# Altium schematic sheet GWC-MCU-002-A - Voltages.SchDoc
size 420 x 297 mm; SheetNumber: 1; SheetTotal: 2; PageSetup: Record=PageOptions|CenterHorizontal=True|CenterVertical=True|PrintScale=0.96|XCorrection=1.00|YCorrection=1.00|PrintKind=1|BorderSize=5000000|LeftOffset=0|BottomOffset=0|Orientation=2|PaperLength=1000|PaperWidth=1000|Scale=100|PaperSource=15|PrintQuality=600|MediaType=1|DitherType=10|PrintScaleMode=1|PaperKind=A3 (297 x 420 mm)|PaperIndex=8
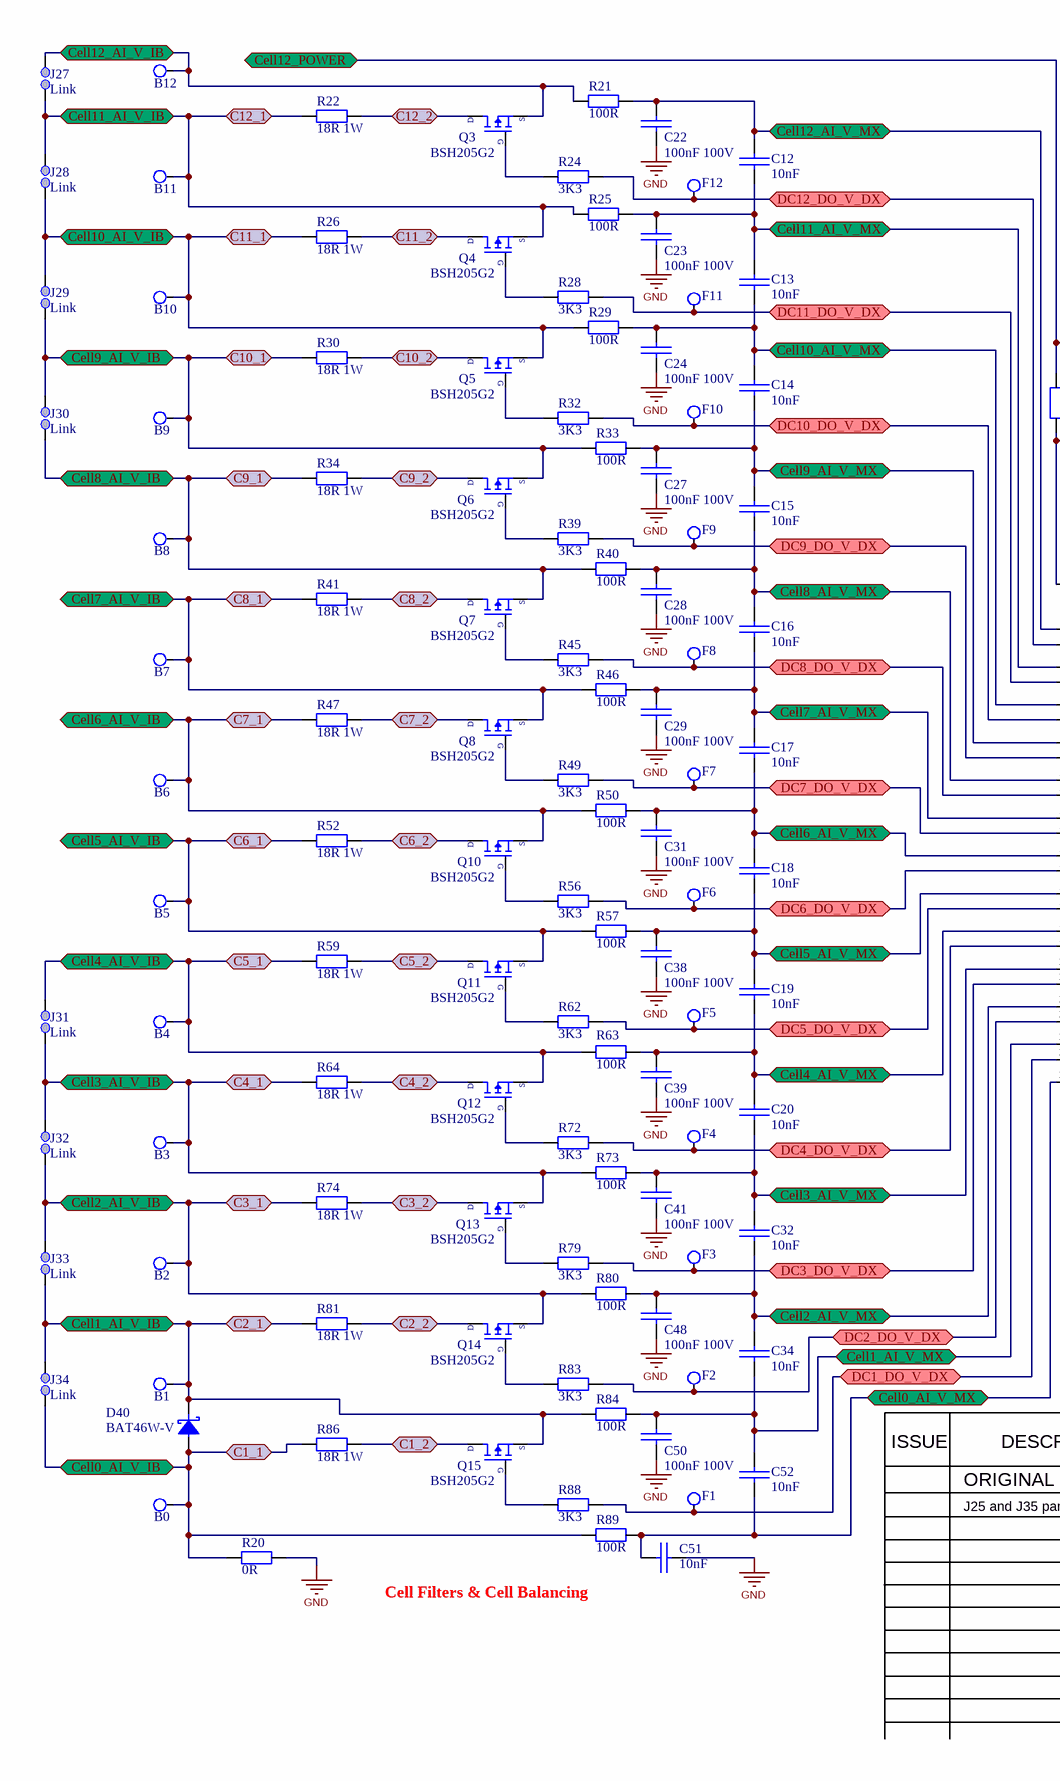
[diagram p0: GWC-MCU-002-A - Voltages.SchDoc, left]
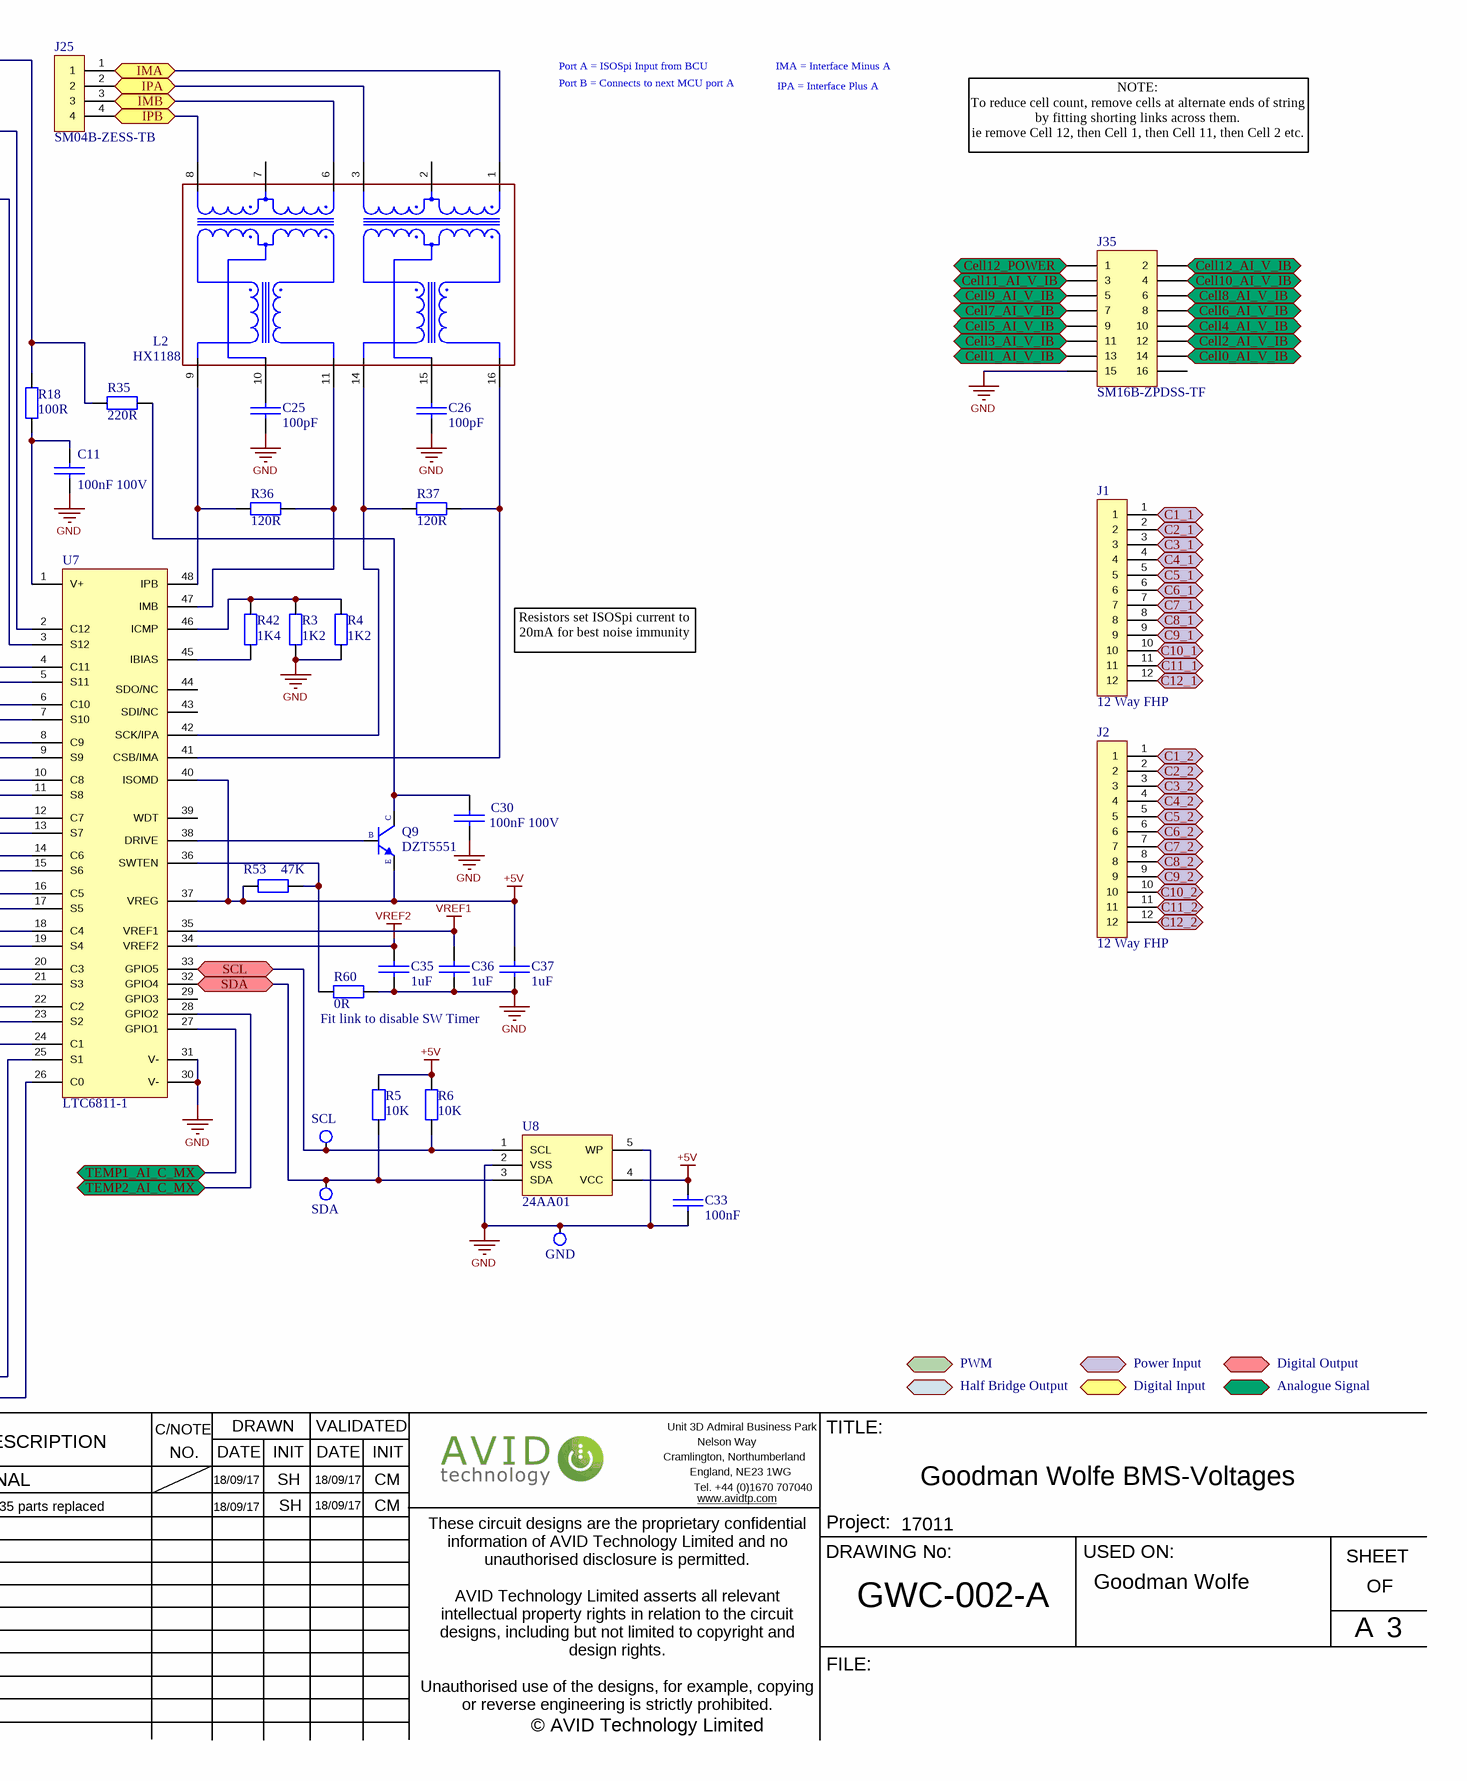
[diagram p1: GWC-MCU-002-A - Voltages.SchDoc, right]

## Parts
B0  TP  [Test Point]  (value not drawn)  (no BOM)
B1  TP  [Test Point]  (value not drawn)  (no BOM)
B2  TP  [Test Point]  (value not drawn)  (no BOM)
B3  TP  [Test Point]  (value not drawn)  (no BOM)
B4  TP  [Test Point]  (value not drawn)  (no BOM)
B5  TP  [Test Point]  (value not drawn)  (no BOM)
B6  TP  [Test Point]  (value not drawn)  (no BOM)
B7  TP  [Test Point]  (value not drawn)  (no BOM)
B8  TP  [Test Point]  (value not drawn)  (no BOM)
B9  TP  [Test Point]  (value not drawn)  (no BOM)
B10  TP  [Test Point]  (value not drawn)  (no BOM)
B11  TP  [Test Point]  (value not drawn)  (no BOM)
B12  TP  [Test Point]  (value not drawn)  (no BOM)
C11  100nF 100V  [C0805]
C12  10nF  [0603]
C13  10nF  [0603]
C14  10nF  [0603]
C15  10nF  [0603]
C16  10nF  [0603]
C17  10nF  [0603]
C18  10nF  [0603]
C19  10nF  [0603]
C20  10nF  [0603]
C22  100nF 100V  [C0805]
C23  100nF 100V  [C0805]
C24  100nF 100V  [C0805]
C25  100pF  [C0603]
C26  100pF  [C0603]
C27  100nF 100V  [C0805]
C28  100nF 100V  [C0805]
C29  100nF 100V  [C0805]
C30  100nF 100V  [C0805]
C31  100nF 100V  [C0805]
C32  10nF  [0603]
C33  100nF  [C0603]
C34  10nF  [0603]
C35  1uF  [C0603]
C36  1uF  [C0603]
C37  1uF  [C0603]
C38  100nF 100V  [C0805]
C39  100nF 100V  [C0805]
C41  100nF 100V  [C0805]
C48  100nF 100V  [C0805]
C50  100nF 100V  [C0805]
C51  10nF  [0603]
C52  10nF  [0603]
D40  BAT46W-V  [SOD-123]
F1  TP  [Test Point]  (value not drawn)  (no BOM)
F2  TP  [Test Point]  (value not drawn)  (no BOM)
F3  TP  [Test Point]  (value not drawn)  (no BOM)
F4  TP  [Test Point]  (value not drawn)  (no BOM)
F5  TP  [Test Point]  (value not drawn)  (no BOM)
F6  TP  [Test Point]  (value not drawn)  (no BOM)
F7  TP  [Test Point]  (value not drawn)  (no BOM)
F8  TP  [Test Point]  (value not drawn)  (no BOM)
F9  TP  [Test Point]  (value not drawn)  (no BOM)
F10  TP  [Test Point]  (value not drawn)  (no BOM)
F11  TP  [Test Point]  (value not drawn)  (no BOM)
F12  TP  [Test Point]  (value not drawn)  (no BOM)
GND  TP  [Test Point]  (value not drawn)  (no BOM)
J1  12 Way FHP  [12 WAY FHP SOCKET]
J2  12 Way FHP  [12 WAY FHP SOCKET]
J25  SM04B-ZESS-TB  [4 Way ZESS Connecctor]
J27  Link  [Solder Link]
J28  Link  [Solder Link]
J29  Link  [Solder Link]
J30  Link  [Solder Link]
J31  Link  [Solder Link]
J32  Link  [Solder Link]
J33  Link  [Solder Link]
J34  Link  [Solder Link]
J35  SM16B-ZPDSS-TF  [16 Way ZPD Connecctor]
L2  HX1188  [SO-16W-Choke]
Q3  BSH205G2  [SOT-23M]
Q4  BSH205G2  [SOT-23M]
Q5  BSH205G2  [SOT-23M]
Q6  BSH205G2  [SOT-23M]
Q7  BSH205G2  [SOT-23M]
Q8  BSH205G2  [SOT-23M]
Q9  DZT5551  [SOT-223T]
Q10  BSH205G2  [SOT-23M]
Q11  BSH205G2  [SOT-23M]
Q12  BSH205G2  [SOT-23M]
Q13  BSH205G2  [SOT-23M]
Q14  BSH205G2  [SOT-23M]
Q15  BSH205G2  [SOT-23M]
R3  1K2  [0603]
R4  1K2  [0603]
R5  10K  [0603]
R6  10K  [0603]
R18  100R  [0603]
R20  0R  [0603]
R21  100R  [0603]
R22  18R 1W  [2512]
R24  3K3  [0603]
R25  100R  [0603]
R26  18R 1W  [2512]
R28  3K3  [0603]
R29  100R  [0603]
R30  18R 1W  [2512]
R32  3K3  [0603]
R33  100R  [0603]
R34  18R 1W  [2512]
R35  220R  [1206]
R36  120R  [0603]
R37  120R  [0603]
R39  3K3  [0603]
R40  100R  [0603]
R41  18R 1W  [2512]
R42  1K4  [0603]
R45  3K3  [0603]
R46  100R  [0603]
R47  18R 1W  [2512]
R49  3K3  [0603]
R50  100R  [0603]
R52  18R 1W  [2512]
R53  47K  [0603]
R56  3K3  [0603]
R57  100R  [0603]
R59  18R 1W  [2512]
R60  0R  [0603]
R62  3K3  [0603]
R63  100R  [0603]
R64  18R 1W  [2512]
R72  3K3  [0603]
R73  100R  [0603]
R74  18R 1W  [2512]
R79  3K3  [0603]
R80  100R  [0603]
R81  18R 1W  [2512]
R83  3K3  [0603]
R84  100R  [0603]
R86  18R 1W  [2512]
R88  3K3  [0603]
R89  100R  [0603]
SCL  TP  [Test Point]  (value not drawn)  (no BOM)
SDA  TP  [Test Point]  (value not drawn)  (no BOM)
U7  LTC6811-1  [SSOP-48]
U8  24AA01  [SOT-23-5]

## Ports
 (bidir), C1_1 (bidir), C1_2 (bidir), C2_1 (bidir), C2_2 (bidir), C3_1 (bidir), C3_2 (bidir), C4_1 (bidir), C4_2 (bidir), C5_1 (bidir), C5_2 (bidir), C6_1 (bidir), C6_2 (bidir), C7_1 (bidir), C7_2 (bidir), C8_1 (bidir), C8_2 (bidir), C9_1 (bidir), C9_2 (bidir), C10_1 (bidir), C10_2 (bidir), C11_1 (bidir), C11_2 (bidir), C12_1 (bidir), C12_2 (bidir), Cell0_AI_V_IB (bidir), Cell0_AI_V_MX (bidir), Cell1_AI_V_IB (bidir), Cell1_AI_V_MX (bidir), Cell2_AI_V_IB (bidir), Cell2_AI_V_MX (bidir), Cell3_AI_V_IB (bidir), Cell3_AI_V_MX (bidir), Cell4_AI_V_IB (bidir), Cell4_AI_V_MX (bidir), Cell5_AI_V_IB (bidir), Cell5_AI_V_MX (bidir), Cell6_AI_V_IB (bidir), Cell6_AI_V_MX (bidir), Cell7_AI_V_IB (bidir), Cell7_AI_V_MX (bidir), Cell8_AI_V_IB (bidir), Cell8_AI_V_MX (bidir), Cell9_AI_V_IB (bidir), Cell9_AI_V_MX (bidir), Cell10_AI_V_IB (bidir), Cell10_AI_V_MX (bidir), Cell11_AI_V_IB (bidir), Cell11_AI_V_MX (bidir), Cell12_AI_V_IB (bidir), Cell12_AI_V_MX (bidir), Cell12_POWER (bidir), DC1_DO_V_DX (bidir), DC2_DO_V_DX (bidir), DC3_DO_V_DX (bidir), DC4_DO_V_DX (bidir), DC5_DO_V_DX (bidir), DC6_DO_V_DX (bidir), DC7_DO_V_DX (bidir), DC8_DO_V_DX (bidir), DC9_DO_V_DX (bidir), DC10_DO_V_DX (bidir), DC11_DO_V_DX (bidir), DC12_DO_V_DX (bidir), IMA (bidir), IMB (bidir), IPA (bidir), IPB (bidir), SCL (bidir), SDA (bidir), TEMP1_AI_C_MX (bidir), TEMP2_AI_C_MX (bidir)

## Nets
+5V: C33.1 C37.2 Q9.E R5.2 R6.2 R53.1 U7.37(VREG) U7.40(ISOMD) U8.4(VCC)
GND: C11.1 C22.1 C23.1 C24.1 C25.1 C26.1 C27.1 C28.1 C29.1 C30.1 C31.1 C33.2 C35.1 C36.1 C37.1 C38.1 C39.1 C41.1 C48.1 C50.1 C51.1 GND.1 J35.15 R3.1 R4.1 R20.2 R60.1 U7.30(V-) U7.31(V-) U8.2(VSS) U8.5(WP)
VREF1: C36.2 U7.35(VREF1)
VREF2: C35.2 U7.34(VREF2)
C1_1: B0.1 D40.A J1.1 J34.2 J35.14 R20.1 R86.2 R89.1 ; port Cell0_AI_V_IB, port C1_1
C1_2: J2.1 Q15.D(D1) R86.1 ; port C1_2
C2_1: B1.1 D40.K J1.2 J33.2 J34.1 J35.13 Q15.S R81.2 R84.1 ; port Cell1_AI_V_IB, port C2_1
C2_2: J2.2 Q14.D(D1) R81.1 ; port C2_2
C3_1: B2.1 J1.3 J32.2 J33.1 J35.12 Q14.S R74.2 R80.1 ; port Cell2_AI_V_IB, port C3_1
C3_2: J2.3 Q13.D(D1) R74.1 ; port C3_2
C4_1: B3.1 J1.4 J31.2 J32.1 J35.11 Q13.S R64.2 R73.1 ; port Cell3_AI_V_IB, port C4_1
C4_2: J2.4 Q12.D(D1) R64.1 ; port C4_2
C5_1: B4.1 J1.5 J31.1 J35.10 Q12.S R59.2 R63.1 ; port Cell4_AI_V_IB, port C5_1
C5_2: J2.5 Q11.D(D1) R59.1 ; port C5_2
C6_1: B5.1 J1.6 J35.9 Q11.S R52.2 R57.1 ; port Cell5_AI_V_IB, port C6_1
C6_2: J2.6 Q10.D(D1) R52.1 ; port C6_2
C7_1: B6.1 J1.7 J35.8 Q10.S R47.2 R50.1 ; port Cell6_AI_V_IB, port C7_1
C7_2: J2.7 Q8.D(D1) R47.1 ; port C7_2
C8_1: B7.1 J1.8 J35.7 Q8.S R41.2 R46.1 ; port Cell7_AI_V_IB, port C8_1
C8_2: J2.8 Q7.D(D1) R41.1 ; port C8_2
C9_1: B8.1 J1.9 J30.2 J35.6 Q7.S R34.2 R40.1 ; port Cell8_AI_V_IB, port C9_1
C9_2: J2.9 Q6.D(D1) R34.1 ; port C9_2
C10_1: B9.1 J1.10 J29.2 J30.1 J35.5 Q6.S R30.2 R33.1 ; port Cell9_AI_V_IB, port C10_1
C10_2: J2.10 Q5.D(D1) R30.1 ; port C10_2
C11_1: B10.1 J1.11 J28.2 J29.1 J35.4 Q5.S R26.2 R29.1 ; port Cell10_AI_V_IB, port C11_1
C11_2: J2.11 Q4.D(D1) R26.1 ; port C11_2
C12_1: B11.1 J1.12 J27.2 J28.1 J35.3 Q4.S R22.2 R25.1 ; port Cell11_AI_V_IB, port C12_1
C12_2: J2.12 Q3.D(D1) R22.1 ; port C12_2
Cell0_AI_V_MX: C51.2 C52.1 R89.2 U7.26(C0) ; port Cell0_AI_V_MX
Cell1_AI_V_MX: C34.1 C50.2 C52.2 R84.2 U7.24(C1) ; port Cell1_AI_V_MX
Cell2_AI_V_MX: C32.1 C34.2 C48.2 R80.2 U7.22(C2) ; port Cell2_AI_V_MX
Cell3_AI_V_MX: C20.1 C32.2 C41.2 R73.2 U7.20(C3) ; port Cell3_AI_V_MX
Cell4_AI_V_MX: C19.1 C20.2 C39.2 R63.2 U7.18(C4) ; port Cell4_AI_V_MX
Cell5_AI_V_MX: C18.1 C19.2 C38.2 R57.2 U7.16(C5) ; port Cell5_AI_V_MX
Cell6_AI_V_MX: C17.1 C18.2 C31.2 R50.2 U7.14(C6) ; port Cell6_AI_V_MX
Cell7_AI_V_MX: C16.1 C17.2 C29.2 R46.2 U7.12(C7) ; port Cell7_AI_V_MX
Cell8_AI_V_MX: C15.1 C16.2 C28.2 R40.2 U7.10(C8) ; port Cell8_AI_V_MX
Cell9_AI_V_MX: C14.1 C15.2 C27.2 R33.2 U7.8(C9) ; port Cell9_AI_V_MX
Cell10_AI_V_MX: C13.1 C14.2 C24.2 R29.2 U7.6(C10) ; port Cell10_AI_V_MX
Cell11_AI_V_MX: C12.1 C13.2 C23.2 R25.2 U7.4(C11) ; port Cell11_AI_V_MX
Cell12_AI_V_IB: B12.1 J27.1 J35.2 Q3.S R21.1 ; port Cell12_AI_V_IB
Cell12_AI_V_MX: C12.2 C22.2 R21.2 U7.2(C12) ; port Cell12_AI_V_MX
Cell12_POWER: J35.1 R18.2 R35.1 ; port Cell12_POWER
DC1_DO_V_DX: F1.1 R88.2 U7.25(S1) ; port DC1_DO_V_DX
DC2_DO_V_DX: F2.1 R83.2 U7.23(S2) ; port DC2_DO_V_DX
DC3_DO_V_DX: F3.1 R79.2 U7.21(S3) ; port DC3_DO_V_DX
DC4_DO_V_DX: F4.1 R72.2 U7.19(S4) ; port DC4_DO_V_DX
DC5_DO_V_DX: F5.1 R62.2 U7.17(S5) ; port DC5_DO_V_DX
DC6_DO_V_DX: F6.1 R56.2 U7.15(S6) ; port DC6_DO_V_DX
DC7_DO_V_DX: F7.1 R49.2 U7.13(S7) ; port DC7_DO_V_DX
DC8_DO_V_DX: F8.1 R45.2 U7.11(S8) ; port DC8_DO_V_DX
DC9_DO_V_DX: F9.1 R39.2 U7.9(S9) ; port DC9_DO_V_DX
DC10_DO_V_DX: F10.1 R32.2 U7.7(S10) ; port DC10_DO_V_DX
DC11_DO_V_DX: F11.1 R28.2 U7.5(S11) ; port DC11_DO_V_DX
DC12_DO_V_DX: F12.1 R24.2 U7.3(S12) ; port DC12_DO_V_DX
IMA: J25.1 L2.1(TD+) ; port IMA
IMB: J25.3 L2.6(RD+) ; port IMB
IPA: J25.2 L2.3(TD-) ; port IPA
IPB: J25.4 L2.8(RD-) ; port IPB
SCL: R6.1 SCL.1 U7.33(GPIO5) U8.1(SCL) ; port SCL
SDA: R5.1 SDA.1 U7.32(GPIO4) U8.3(SDA) ; port SDA
TEMP1_AI_C_MX: U7.27(GPIO1) ; port TEMP1_AI_C_MX
TEMP2_AI_C_MX: U7.28(GPIO2) ; port TEMP2_AI_C_MX
NetC11_2: C11.2 R18.1 U7.1(V+)
NetC25_2: C25.2 L2.10(CMT)
NetC26_2: C26.2 L2.15(CMT)
NetC30_2: C30.2 Q9.C R35.2
NetL2_9: L2.9(RX-) R36.1 U7.48(IPB)
NetL2_11: L2.11(RX+) R36.2 U7.47(IMB)
NetL2_14: L2.14(TX-) R37.1 U7.42(SCK/IPA)
NetL2_16: L2.16(TX+) R37.2 U7.41(CSB/IMA)
NetQ3_G: Q3.G R24.1
NetQ4_G: Q4.G R28.1
NetQ5_G: Q5.G R32.1
NetQ6_G: Q6.G R39.1
NetQ7_G: Q7.G R45.1
NetQ8_G: Q8.G R49.1
NetQ9_B: Q9.B U7.38(DRIVE)
NetQ10_G: Q10.G R56.1
NetQ11_G: Q11.G R62.1
NetQ12_G: Q12.G R72.1
NetQ13_G: Q13.G R79.1
NetQ14_G: Q14.G R83.1
NetQ15_G: Q15.G R88.1
NetR3_2: R3.2 R4.2 R42.2 U7.46(ICMP)
NetR42_1: R42.1 U7.45(IBIAS)
NetR53_2: R53.2 R60.2 U7.36(SWTEN)

Not connected (* = marked no-connect by the designer): J35 16; L2 2(TCT) 7(RCT); U7 29(GPIO3) 39(WDT) 43(SDI/NC) 44(SDO/NC)

## Notes on the sheet
- Port A = ISOSpi Input from BCU
- Port B = Connects to next MCU port A
- IMA = Interface Minus A
- IPA = Interface Plus A
- NOTE:
  To reduce cell count, remove cells at alternate ends of string by fitting shorting links across them.
  ie remove Cell 12, then Cell 1, then Cell 11, then Cell 2 etc.
- Resistors set ISOSpi current to 20mA for best noise immunity
- Fit link to disable SW Timer
- Half Bridge Output
- PWM
- Digital Input
- Power Input
- Digital Output
- Analogue Signal
- ISSUE
- ORIGINAL
- DESCRIPTION
- C/NOTE
- NO.
- DATE
- DRAWN
- 18/09/17
- INIT
- SH
- VALIDATED
- CM
- Cramlington, Northumberland
- Unit 3D Admiral Business Park
- England, NE23 1WG
- Tel. +44 (0)1670 707040
- Nelson Way
- www.avidtp.com
- TITLE:
- Goodman Wolfe BMS-Voltages
- J25 and J35 parts replaced
- DRAWING No:
- Project:
- 17011
- USED ON:
- SHEET
- Cell Filters & Cell Balancing
- GWC-002-A
- Goodman Wolfe
- A
- OF
- 3
- © AVID Technology Limited
- FILE:
- These circuit designs are the proprietary confidential information of AVID Technology Limited and no unauthorised disclosure is permitted.
  AVID Technology Limited asserts all relevant intellectual property rights in relation to the circuit designs, including but not limited to copyright and design rights.
  Unauthorised use of the designs, for example, copying or reverse engineering is strictly prohibited.

## Library data of the parts
B0-B12 F1-F12 GND SCL SDA = TP: Test point; Manufacturer: NA; Specification: 1.5mm dia Single Sided; Part Number: Test Point; Component Type: Pad
C11 C22-C24 C27-C31 C38 C39 C41 C48 C50 = 100nF X7R 0805: 100nF 0805 Non Polarised Capacitor; Manufacturer: AVX; Part Number: 08051C104K4T2A; Tolerance: 10%; Specification: X7R 100V; Component Type: SMD; Supplier: Farnell; Supplier No.: 183-3888; Supplier 1: Farnell; Supplier 2: Digi-Key; Supplier 3: Arrow; Supplier 4: Newark; Supplier Part Number 1: 1833888; Supplier Part Number 2: 478-4525-1-ND; Supplier Part Number 3: thCAXxQKhySVZl-gwSbrFi2B4okyfaS8lrYqWDAKxeI; Supplier Part Number 4: 85R5692
C12-C20 C32 C34 C52 = 10nF 0603 X7R: 10nF Non Polarised Capacitor; Part Number: C0603C103K5RACTU; Manufacturer: Kemet; Specification: X7R 50V; Tolerance: 10%; Component Type: SMD; Supplier: Farnell; Supplier No.: 141-4609; Supplier 1: Farnell; Supplier 2: Digi-Key; Supplier Part Number 1: 1414609; Supplier Part Number 2: 399-1091-1-ND
C25 C26 = 100pF 0603 COG: 100pF Non Polarised Capacitor; Manufacturer: Murata; Part Number: GRM1885C1H101JA01D; Tolerance: 5%; Specification: COG; Component Type: SMD; Supplier: Farnell; Supplier No.: 881-9866; Supplier 2: Digi-Key; Supplier Part Number 2: 490-1427-1-ND; Supplier 1: Farnell; Supplier Part Number 1: 8819866
C33 = 100nF X7R 0603: 100nF 0603 Non Polarised Capacitor; Manufacturer: Kemet; Part Number: C0603C104K5RAC; Tolerance: 10%; Specification: X7R 50V; Component Type: SMD; Supplier: Farnell; Supplier No.: 128-8255; Supplier 1: Farnell; Supplier 2: Digi-Key; Supplier 3: Arrow; Supplier 4: Newark; Supplier Part Number 1: 1288255; Supplier Part Number 2: 399-5089-1-ND; Supplier Part Number 3: 13owRFewPNmjSPXc-JuBeSWHfU3DuBufwBIDEpzGmQ0; Supplier Part Number 4: 72J5992
C35-C37 = 1uF X7R 0603: 1uF Non Polarised Capacitor; Part Number: C0603C105K4RACTU; Manufacturer: Kemet; Tolerance: 10%; Specification: X7R 16V; Component Type: SMD; Supplier: Farnell; Supplier No.: 165-0837; Supplier 1: Farnell; Supplier 2: Digi-Key; Supplier Part Number 1: 1650837; Supplier Part Number 2: 399-7847-1-ND
C51 = 10nF 0603 X7R: 10nF Non Polarised Capacitor; Manufacturer: Kemet; Part Number: C0603C103K5RACTU; Tolerance: 10%; Specification: X7R 50V; Component Type: SMD; Supplier: Farnell; Supplier No.: 141-4609; Supplier 1: Farnell; Supplier 2: Digi-Key; Supplier Part Number 1: 1414609; Supplier Part Number 2: 399-1091-1-ND
D40 = BAT46W-V: Small Signal Schottky Diode; Part Number: BAT46W-V / GS08; Manufacturer: Vishay; Specification: 100V 150mA; Component Type: SMD; Supplier: Farnell; Supplier No.: 161-2327; Supplier 1: Farnell; Supplier Part Number 1: 1612327
J1 J2 = 12 Way FHP SMT: Manufacturer: Samtec; Part Number: FHP-12-02-T-S; Specification: 3.96mm pitch; Component Type: SMT; Supplier: Samtec; Supplier No.: FHP-12-02-T-S; Supplier 1: Farnell; Supplier Part Number 1: 1931569
J25 = 4 Way CPT (Side Entry): 4 Way CPT Connector (Side Entry); Manufacturer: JST; Part Number: SM04B1-CPTK-1A-TB; Specification: 3A 50V; Component Type: SMD; Supplier: Mouser; Supplier No.: 306-SM04B1-CPTK-1ATB
J27-J34 = Link Pad: Bridge Link Pads; Component Type: Pad
J35 = Header 8X2: Header, 16-Pin, Dual row, SM16B-ZPDSS-TF; LatestRevisionDate: 17-Jul-2002; LatestRevisionNote: Re-released for DXP Platform.; Publisher: Altium Limited
L2 = HX1188FNL: Dual Ethernet Transformer & CM Choke; Manufacturer: Pulse; Part Number: HX1188FNLT; Specification: -40/+85 deg C 350uH 1:1; Component Type: SMD; Supplier: Mouser; Supplier No.: 673-HX1188FNLT; Supplier 1: Mouser; Supplier 2: Digi-Key; Supplier Part Number 1: 673-HX1188FNLT; Supplier Part Number 2: 553-2208-1-ND
Q3-Q8 Q10-Q15 = BSH205: P Channel MOSFET; Manufacturer: NXP; Specification: P-CH 20V 2A 0.12R; Part Number: BSH205G2; Component Type: SMD; Supplier: Farnell; Supplier No.: 249-8570; Supplier 1: Farnell; Supplier Part Number 1: 2498570
Q9 = DZT5551: NPN Transistor; Manufacturer: DIODES; Specification: 160V, 2W, 600mA; Part Number: DZT5551; Component Type: SMD; Supplier: Farnell; Supplier No.: 206-1423; Supplier 1: Farnell; Supplier 2: Newark; Supplier Part Number 1: 2061423; Supplier Part Number 2: 65T8243
R3 R4 = 1K2 0603 Resistor: Manufacturer: Multicomp; Part Number: MCHP03W8F1201T5E; Specification: 0.125W 50V; Component Type: SMD; Supplier: Farnell; Supplier No.: 157-6284; Supplier 1: Farnell; Supplier Part Number 1: 1576284
R5 R6 = 10K 0603 Resistor: Manufacturer: Phycomp; Part Number: 2322 7046 1003; Tolerance: 1%; Specification: 0.063W 50V; Component Type: SMD; Supplier: Farnell; Supplier No.: 111-7235; Supplier 1: Farnell; Supplier Part Number 1: 1117235
R18 R21 R25 R29 R33 R40 R46 R50 R57 R63 R73 R80 R84 R89 = 100R 0603 Resistor: Manufacturer: Multicomp; Part Number: MC 0.063W 0603 1% 100R; Tolerance: 1%; Specification: 0.063W 50V; Component Type: SMD; Supplier: Farnell; Supplier No.: 933-0364; Supplier 1: Farnell; Supplier Part Number 1: 9330364
R20 R60 = 0R 0603 Link: Part Number: MC 0.063W 0603 0R; Manufacturer: Multicomp; Tolerance: 1%; Specification: 0.1W 50V; Component Type: SMD; Supplier: Farnell; Supplier No.: 933-1662; Supplier 1: Farnell; Supplier Part Number 1: 9331662
R22 R26 R30 R34 R41 R47 R52 R59 R64 R74 R81 R86 = 18R 2512 Resistor: Manufacturer: Tyco; Part Number: 352018RJT; Tolerance: 5%; Specification: 1W; Component Type: SMD; Supplier: Farnell; Supplier No.: 126-5175; Supplier 1: Farnell; Supplier 2: RS-Components; Supplier 3: Mouser; Supplier 4: Newark; Supplier Part Number 1: 1265175; Supplier Part Number 2: 224-0171; Supplier Part Number 3: 279-352018RJT; Supplier Part Number 4: 18R3518
R24 R28 R32 R39 R45 R49 R56 R62 R72 R79 R83 R88 = 3K3 0603 Resistor: Manufacturer: Multicomp; Part Number: MC 0.063W 0603 1% 3K3; Tolerance: 1%; Specification: 0.1W 50V; Component Type: SMD; Supplier: Farnell; Supplier No.: 933-1026; Supplier 1: Farnell; Supplier Part Number 1: 9331026
R35 = 220R 1206 Resistor: Manufacturer: Tyco Electronics; Part Number: CRG1206F220R; Tolerance: 1%; Specification: 0.25W; Component Type: SMD; Supplier: RS; Supplier No.: 223-2164; Supplier 1: RS-Components; Supplier Part Number 1: 223-2164
R36 R37 = 120R 0603 Resistor: Manufacturer: Vishay; Part Number: CRCW0603120RFKEAHP; Tolerance: 1%; Specification: 0.25W 75V; Component Type: SMD; Supplier: Farnell; Supplier No.: 173-8892; Supplier 1: Farnell; Supplier 2: Newark; Supplier Part Number 1: 1738892; Supplier Part Number 2: 41R4624
R42 = 1K4 0603 Resistor: Manufacturer: Vishay; Part Number: CRCW06031K40FKEA; Tolerance: 1%; Specification: 0.1W 75V; Component Type: SMD; Supplier: Farnell; Supplier No.: 146-9742; Supplier 1: Farnell; Supplier 2: Mouser; Supplier 3: Digi-Key; Supplier Part Number 1: 1469742; Supplier Part Number 2: 71-CRCW0603-1.4K-E3; Supplier Part Number 3: 541-1.40KHCT-ND
R53 = 47K 0603 Resistor: Manufacturer: Phycomp; Part Number: 2322 7046 4703; Tolerance: 1%; Specification: 0.1W 50V; Component Type: SMD; Supplier: Farnell; Supplier No.: 923-8689; Supplier 1: Farnell; Supplier Part Number 1: 9238689
U7 = LTC6811-1: Multicell  Battery Stack Monitor; Manufacturer: Linear Tech; Part Number: LTC6811G-1; Specification: 60V; Component Type: SMD; Supplier: Linear; Supplier No.: LTC6811G-1
U8 = 24AA01: 1K I2C EEPROM; Manufacturer: Atmel; Part Number: 24AA01T-I/OT; Specification: -40/+85 deg C 1.7-5.5V; Component Type: SMD; Supplier: Farnell; Supplier No.: 133-1269; Supplier 1: Farnell; Supplier 2: Digi-Key; Supplier 3: Arrow; Supplier 4: TME; Supplier 5: Newark; Supplier Part Number 1: 1331269; Supplier Part Number 2: 24AA01T-I/OTCT-ND; Supplier Part Number 3: qa4xD_1fnMD5lAuD9KKDLGSjiRfODrYyphIlkbDuu6Y; Supplier Part Number 4: 24AA01T-I/OT; Supplier Part Number 5: 35M0694